# EAGLE schematic SC182029-V2R0-Encoder (EAGLE 9.4.0)
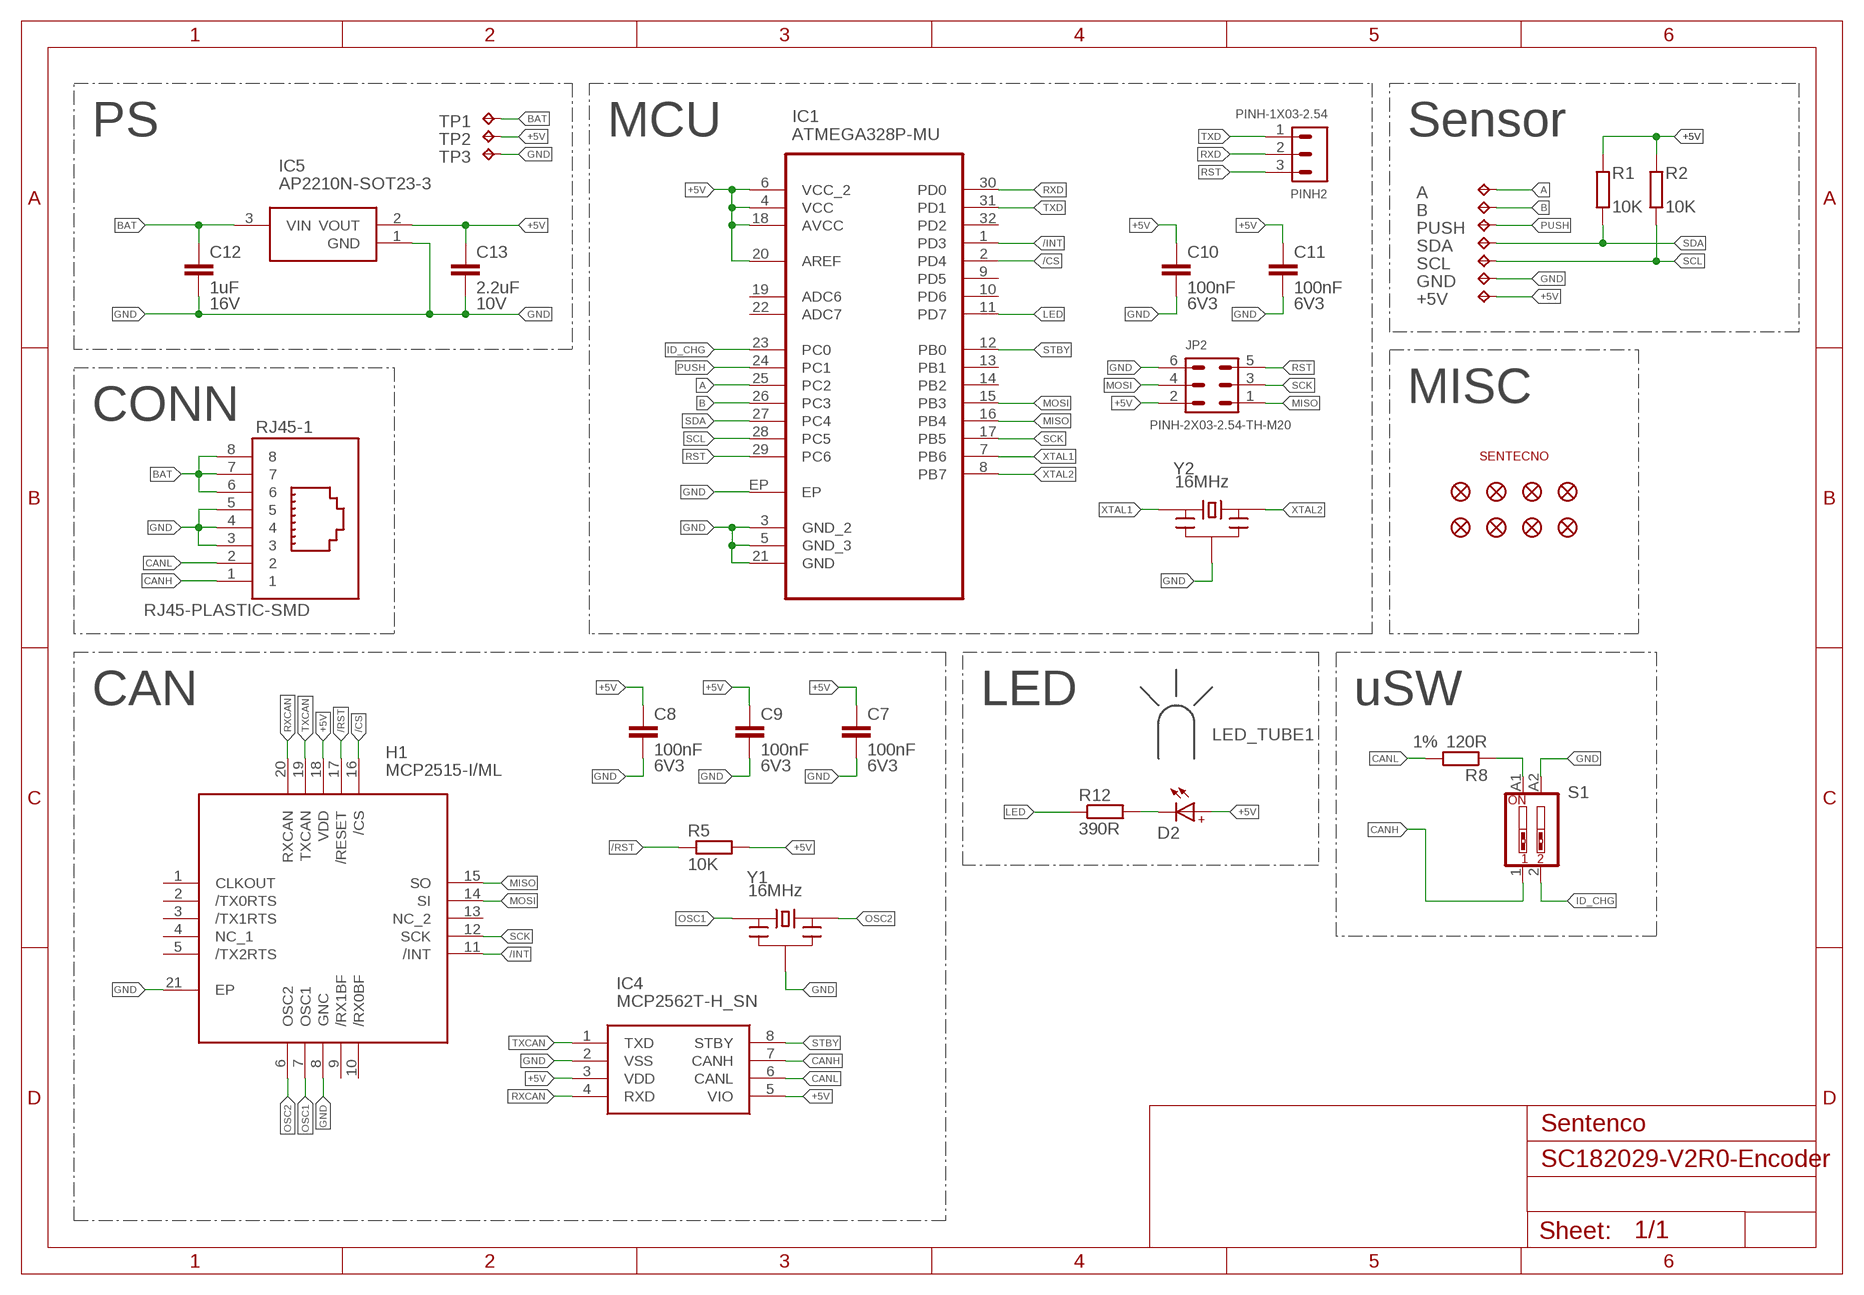
[diagram p0: schematic, sheet 1]

## Parts
+5V  TPTP20SQ  [TP20SQ]
A  TPTP20SQ  [TP20SQ]
B  TPTP20SQ  [TP20SQ]
C7  100nF  COND_CERAMICO_SMD0603R  [C0603R]
C8  100nF  COND_CERAMICO_SMD0603R  [C0603R]
C9  100nF  COND_CERAMICO_SMD0603R  [C0603R]
C10  100nF  COND_CERAMICO_SMD0603R  [C0603R]
C11  100nF  COND_CERAMICO_SMD0603R  [C0603R]
C12  1uF  COND_CERAMICO_SMD0603R  [C0603R]
C13  2.2uF  COND_CERAMICO_SMD0603R  [C0603R]
D2  WL-SMCW-150060BS75000  [WL-SMCW_0603]
FID1  FIDUCIALUFIDUCIAL  [MICRO-FIDUCIAL]
FID2  FIDUCIALUFIDUCIAL  [MICRO-FIDUCIAL]
FID3  FIDUCIALUFIDUCIAL  [MICRO-FIDUCIAL]
FID4  FIDUCIALUFIDUCIAL  [MICRO-FIDUCIAL]
FID5  FIDUCIALUFIDUCIAL  [MICRO-FIDUCIAL]
FID6  FIDUCIALUFIDUCIAL  [MICRO-FIDUCIAL]
FID7  FIDUCIALUFIDUCIAL  [MICRO-FIDUCIAL]
FID8  FIDUCIALUFIDUCIAL  [MICRO-FIDUCIAL]
GND  TPTP20SQ  [TP20SQ]
H1  MCP2515-I/ML  [QFN50P400X400X90-21N]
IC1  ATMEGA328P-MU  [QFN50P500X500X100-33N]
IC4  MCP2562T-H_SN  [SOIC127P600X175-8N]
IC5  AP2210N-SOT23-3  [SOT95P280X130-3N]
JP2  PINH-2X03-2.54-TH-M20  [HDRV6W64P254_2X3_762X508X868P]
LED_TUBE1  LED_TUBEH1  [LED_TUBE_2]
LOGO1  LOGO_SENTECNOLOGO_6X4MM  [LOGO_6X4MM]
PINH2  PINH-1X03-2.54  [PINH-1X03-2.54-1]
PUSH  TPTP20SQ  [TP20SQ]
R1  10K  RES_CERAMICA_SMD0603R  [R0603R]
R2  10K  RES_CERAMICA_SMD0603R  [R0603R]
R5  10K  RES_CERAMICA_SMD0603R  [R0603R]
R8  120R  RES_CERAMICA_SMD0603R  [R0603R]
R12  390R  RES_CERAMICA_SMD0603R  [R0603R]
RJ45-1  RJ45-PLASTIC-SMD  [73304111LF]
S1  DIP-SW-2  [SMD-DIP-SWITCH-2P]
SCL  TPTP20SQ  [TP20SQ]
SDA  TPTP20SQ  [TP20SQ]
TP1  TPTP08R  [TP0.8MMR]
TP2  TPTP08R  [TP0.8MMR]
TP3  TPTP08R  [TP0.8MMR]
Y1  16MHz  RESONADOR_CERAMICO-UNKN1  [CSTNE16M0V530000R0]
Y2  16MHz  RESONADOR_CERAMICO-UNKN1  [CSTNE16M0V530000R0]

## Nets
+5V: +5V.TP C7.1 C8.1 C9.1 C10.1 C11.1 C13.1 D2.2(+) H1.18(VDD) IC1.4(VCC) IC1.6(VCC_2) IC1.18(AVCC) IC1.20(AREF) IC4.3(VDD) IC4.5(VIO) IC5.2(VOUT) JP2.2 R1.2 R2.2 R5.2 TP2.TP
/CS: H1.16(/CS) IC1.2(PD4)
/INT: H1.11(/INT) IC1.1(PD3)
/RST: H1.17(/RESET) R5.1
A: A.TP IC1.25(PC2)
B: B.TP IC1.26(PC3)
BAT: C12.1 IC5.3(VIN) RJ45-1.6 RJ45-1.7 RJ45-1.8 TP1.TP
CANH: IC4.7(CANH) RJ45-1.1 S1.1
CANL: IC4.6(CANL) R8.2 RJ45-1.2
GND: C7.2 C8.2 C9.2 C10.2 C11.2 C12.2 C13.2 GND.TP H1.8(GNC) H1.21(EP) IC1.3(GND_2) IC1.5(GND_3) IC1.21(GND) IC1.EP IC4.2(VSS) IC5.1(GND) JP2.6 RJ45-1.3 RJ45-1.4 RJ45-1.5 S1.A2 TP3.TP Y1.2(GND) Y2.2(GND)
ID_CHG: IC1.23(PC0) S1.2
LED: IC1.11(PD7) R12.1
MISO: H1.15(SO) IC1.16(PB4) JP2.1
MOSI: H1.14(SI) IC1.15(PB3) JP2.4
N$2: R8.1 S1.A1
N$7: D2.1(-) R12.2
OSC1: H1.7(OSC1) Y1.3(OUT)
OSC2: H1.6(OSC2) Y1.1(IN)
PUSH: IC1.24(PC1) PUSH.TP
RST: IC1.29(PC6) JP2.5 PINH2.3
RXCAN: H1.20(RXCAN) IC4.4(RXD)
RXD: IC1.30(PD0) PINH2.2
SCK: H1.12(SCK) IC1.17(PB5) JP2.3
SCL: IC1.28(PC5) R2.1 SCL.TP
SDA: IC1.27(PC4) R1.1 SDA.TP
STBY: IC1.12(PB0) IC4.8(STBY)
TXCAN: H1.19(TXCAN) IC4.1(TXD)
TXD: IC1.31(PD1) PINH2.1
XTAL1: IC1.7(PB6) Y2.3(OUT)
XTAL2: IC1.8(PB7) Y2.1(IN)
Unconnected: H1.1(CLKOUT) H1.2(/TX0RTS) H1.3(/TX1RTS) H1.4(NC_1) H1.5(/TX2RTS) H1.9(/RX1BF) H1.10(/RX0BF) H1.13(NC_2) IC1.9(PD5) IC1.10(PD6) IC1.13(PB1) IC1.14(PB2) IC1.19(ADC6) IC1.22(ADC7) IC1.32(PD2)

## Notes on the sheet
- PS | MCU | Sensor
- MISC
- CONN
- CAN | LED | uSW
- Sentenco

## Library data of the parts
+5V A B GND PUSH SCL SDA TP1-TP3 = sentecno_misc:TP: Test pad
C7-C11 = sentecno_pasivos:COND_CERAMICO_SMD: Condensador ceramico SMD; MAN1: AVX; MAN1PN: 0603YC104KAT2A; SENTPN: CCSMD-0603-104-6V3; VALUE2: 6V3
C12 = sentecno_pasivos:COND_CERAMICO_SMD: Condensador ceramico SMD; MAN1: Taiyo Yuden; MAN1PN: LMK107B7105KA-T; SENTPN: CCSMD-0603R-105-16V; VALUE2: 16V
C13 = sentecno_pasivos:COND_CERAMICO_SMD: Condensador ceramico SMD; MAN1: Taiyo Yuden; MAN1PN: EMK107BJ225MA-T; SENTPN: CCSMD-0603R-225-10V; VALUE2: 10V
D2 = sentecno_optoelectronica:WL-SMCW: SMD mono-color Chip LED Characteristics Low energy consumption High reliability Low current requirement Fast switching No UV/IR radiation Smallest SMD package with exceptional brightness Top view Wide viewing angle PBC high-usage Applications Backlight for mobile and portable device keypads Indoor and outdoor message boards Flat backlight for LCDs, switches and symbols Display for industrial control systems and traffic Miniaturized color effects Pedestrian mark Optical indicators General lighting Toys <http://katalog.we-online.de/media/images/v2/Family_WL-SMCW.jpg> Details see: http://katalog.we-online.de/en/led/WL-SMCW?m Updated 2015-04-10 2015 (C) Wurth Elektronik; MAN1: Inolux; MAN1PN: IN-S63AT5G; SENTPN: LEDSMD-0603-GREEN
FID1-FID8 = sentecno_misc:FIDUCIAL: Fiducial Alignment Points Various fiducial points for machine vision alignment.
H1 = sentecno_integrados:MCP2515-I/ML: Stand-Alone CAN Controller SPI QFN20 Microchip MCP2515-E/ML, CAN Controller 1MBps CAN 2.0B, 20-Pin QFN Source: Datasheet <https://componentsearchengine.com/Datasheets/2/MCP2515-E_ML.pdf>; MAN1: Microchip; MAN1PN: MCP2515-I/ML; NOTES: H0.9mm; SENTPN: MCP2515-I/ML
IC1 = sentecno_integrados:ATMEGA328P-MU: Programmable Flash; MAN1: Microchip Technology / Atmel; MAN1PN: ATMEGA328P-MU; SENTPN: ATMEGA328P-MU
IC4 = sentecno_integrados:MCP2562T-H_SN: CAN Interface IC Source: Datasheet <https://componentsearchengine.com/Datasheets/1/MCP2562T-H_SN.pdf>; MAN1: Microchip; MAN1PN: MCP2562T-H/SN; NOTES: H1.75mm; SENTPN: MCP2562T-H/SN
IC5 = sentecno_alimentacion:AP2210N: DiodesZetex AP2210N, Low Noise LDO Voltage Regulator, 300mA, 2%, 2.5 13.2 Vin, 3-Pin SOT-23; MAN1: Diodes Inc.; MAN1PN: AP2210N-5.0TRG1; NOTES: H1.3mm; SENTPN: AP2210N-5.0TRG1
JP2 = sentecno_conectores:PINH-2X03; MAN1: Harwin; MAN1PN: M20-9980346; SENTPN: PINH-2X03-2.54
LED_TUBE1 = sentecno_optoelectronica:LED_TUBE; MAN1: Bivar; MAN1PN: SLP3-150-150-F; SENTPN: SLP3-150-150-F
LOGO1 = sentecno_misc:LOGO_SENTECNO
PINH2 = sentecno_conectores:PINH-1X03; BLOCK: NM; SENTPN: PINH-M-1x03-2.54
R1 R2 = sentecno_pasivos:RES_CERAMICA_SMD: Resistencia ceramica SMD; MAN1: Yageo; MAN1PN: RC0603JR-074K7L; SENTPN: RSMD-0603-4K7
R5 = sentecno_pasivos:RES_CERAMICA_SMD: Resistencia ceramica SMD; MAN1: Bourns; MAN1PN: CR0603-JW-103ELF; SENTPN: RSMD-0603-10K
R8 = sentecno_pasivos:RES_CERAMICA_SMD: Resistencia ceramica SMD; MAN1: Yageo; MAN1PN: RC0603FR-07120RL; SENTPN: RSMD-0603R-120R-10; VALUE2: 1%
R12 = sentecno_pasivos:RES_CERAMICA_SMD: Resistencia ceramica SMD; MAN1: Yageo; MAN1PN: RC0603FR-07390RL; SENTPN: RSMD-0603-390R
RJ45-1 = sentecno_conectores:RJ45-PLASTIC: WR-MJ Horizontal Plastic 8P8C Modular Jack Tab Down, 8 Pins=>Code : Con_I_O_MJ-H_Plastic_Down_615008137121 <http://katalog.we-online.de/media/images/eican/Con_I_O_MJ-H_Plastic_Down_615008137121_pf2.jpg> Details see: http://katalog.we-online.de/en/em/615_008_137_121 Created 2014-07-10, Karrer Zheng 2014 (C) Würth Elektronik; MAN1: Amphenol FCI; MAN1PN: 73304-111LF; NOTES: H14mm; SENTPN: CONSTD-RJ45-SMD-90
S1 = sentecno_electromecanicos:DIP-SW-2; MAN1: CTS Electronic Components; MAN1PN: 219-2MST; SENTPN: SWSMD-1x02
Y1 Y2 = sentecno_pasivos:RESONADOR_CERAMICO; MAN1: Murata Electronics; MAN1PN: CSTNE16M0V530000R0; NOTES: H0.9mm; SENTPN: CRES-3.2x1.3-16MHz